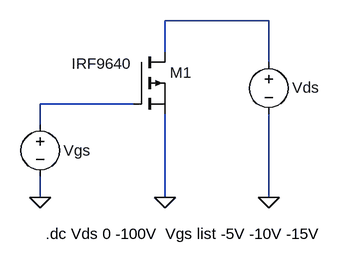
[diagram p0: schematic MOS-OUT-4.asc]
MOS-OUT-4.asc, the LTspice schematic file:
Version 4
SHEET 1 1292 680
WIRE -560 -144 -720 -144
WIRE -720 -96 -720 -144
WIRE -560 -80 -560 -144
WIRE -768 -16 -912 -16
WIRE -912 16 -912 -16
WIRE -912 128 -912 96
WIRE -720 128 -720 0
WIRE -560 128 -560 0
FLAG -560 128 0
FLAG -912 128 0
FLAG -720 128 0
SYMBOL voltage -560 -96 R0
WINDOW 123 0 0 Left 2
WINDOW 39 37 60 Left 2
WINDOW 0 36 55 Left 2
WINDOW 3 37 60 Left 2
SYMATTR InstName Vds
SYMATTR Value ""
SYMBOL voltage -912 0 R0
WINDOW 123 0 0 Left 2
WINDOW 39 40 53 Left 2
WINDOW 3 40 69 Left 2
WINDOW 0 36 56 Left 2
SYMATTR Value ""
SYMATTR InstName Vgs
SYMBOL pmos -768 -96 R0
WINDOW 3 -96 18 Left 2
SYMATTR InstName M1
SYMATTR Value IRF9640
TEXT -904 184 Left 2 !.dc Vds 0 -100V  Vgs list -5V -10V -15V

The netlist it stands for:
* MOS-OUT-4.asc
Vds N001 0
Vgs N002 0
M1 N001 N002 0 0 IRF9640
.model NMOS NMOS
.model PMOS PMOS
.lib standard.mos
.dc Vds 0 -100V  Vgs list -5V -10V -15V
.backanno
.end